# EAGLE design irthrowie (EAGLE 7.1.0)
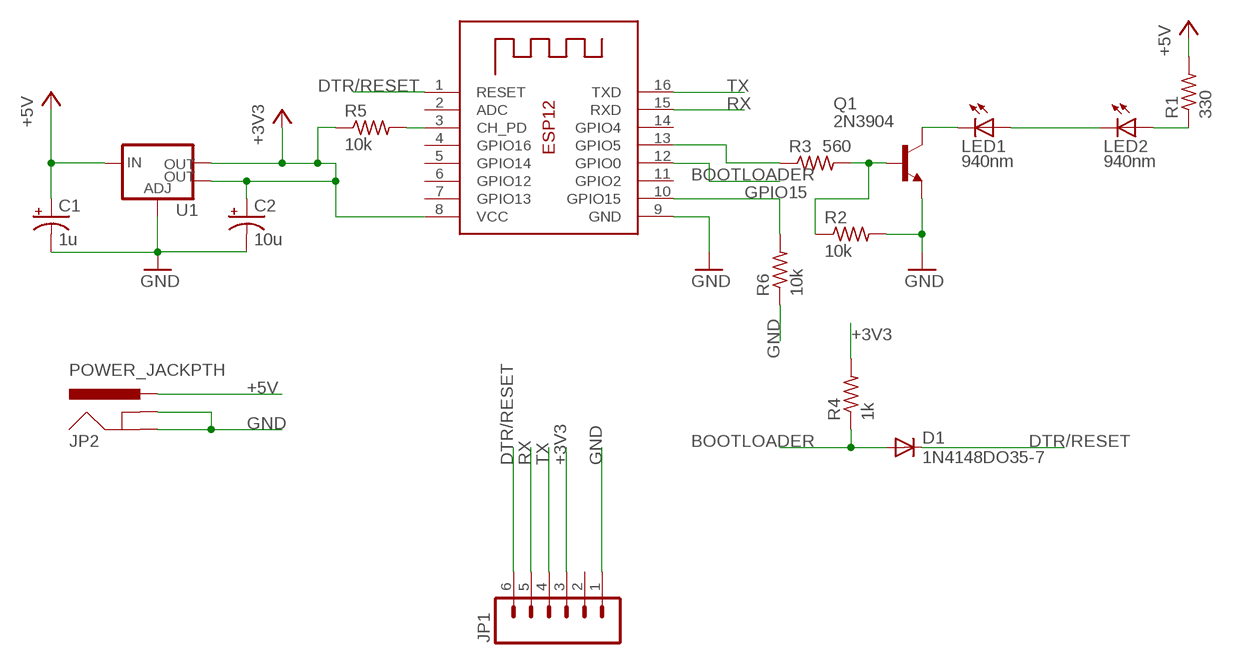
[diagram p0: schematic, sheet 1]

## Parts
C1  1u  CPOL-USB  [PANASONIC_B]
C2  10u  CPOL-USB  [PANASONIC_B]
D1  1N4148DO35-7  [DO35-7]
JP1  M06LOCK  [1X06_LOCK]
JP2  POWER_JACKPTH  [POWER_JACK_PTH]
LED1  940nm  LED5MM  [LED5MM]
LED2  940nm  LED5MM  [LED5MM]
Q1  2N3904  [TO92]
R1  330  R-US_0204/7  [0204/7]
R2  10k  R-US_0204/7  [0204/7]
R3  560  R-US_0204/7  [0204/7]
R4  1k  R-US_0204/7  [0204/7]
R5  10k  R-US_0204/7  [0204/7]
R6  10k  R-US_0204/7  [0204/7]
U1  V_REG_LM1117SOT223  [SOT223]
X1  ESP-12  [ESP-12]

## Nets
+3V3 [power]: C2.+ JP1.3 R4.2 R5.1 U1.2(OUT) U1.4(OUT) X1.8(VCC)
+5V [power]: C1.+ JP2.PWR R1.2 U1.3(IN)
BOOTLOADER: D1.A R4.1 X1.12(GPIO0)
DTR/RESET: D1.C JP1.6 X1.1(RESET)
GND [power]: C1.- C2.- JP1.1 JP2.GND JP2.GNDBREAK Q1.3(E) R2.2 R6.1 U1.1(ADJ) X1.9(GND)
GPIO15: R6.2 X1.10(GPIO15)
N$1 [power]: LED1.A LED2.K(C)
N$2: Q1.2(B) R2.1 R3.2
N$3 [power]: LED1.K(C) Q1.1(C)
N$4 [power]: LED2.A R1.1
N$5: R5.2 X1.3(CH_PD)
N$6: R3.1 X1.13(GPIO5)
RX: JP1.5 X1.15(RXD)
TX: JP1.4 X1.16(TXD)
Unconnected: JP1.2 X1.2(ADC) X1.4(GPIO16) X1.5(GPIO14) X1.6(GPIO12) X1.7(GPIO13) X1.11(GPIO2) X1.14(GPIO4)

## Library data of the parts
C1 C2 = rcl:CPOL-US: POLARIZED CAPACITOR, American symbol
D1 = diode:1N4148: DIODE high speed (Philips)
JP1 = SparkFun-Connectors:M06: Header 6 Standard 6-pin 0.1" header. Use with straight break away headers (SKU : PRT-00116), right angle break away headers (PRT-00553), swiss pins (PRT-00743), machine pins (PRT-00117), and female headers (PRT-00115). Molex polarized connector foot print use with SKU : PRT-08094 with associated crimp pins and housings. NOTES ON THE VARIANTS LOCK and LOCK_LONGPADS... This footprint was designed to help hold the alignment of a through-hole component (i.e. 6-pin header) while soldering it into place. You may notice that each hole has been shifted either up or down by 0.005 of an inch from it's more standard position (which is a perfectly straight line). This slight alteration caused the pins (the squares in the middle) to touch the edges of the holes. Because they are alternating, it causes a "brace" to hold the component in place. 0.005 has proven to be the perfect amount of "off-center" position when using our standard breakaway headers. Although looks a little odd when you look at the bare footprint, once you have a header in there, the alteration is very hard to notice. Also,if you push a header all the way into place, it is covered up entirely on the bottom side. This idea of altering the position of holes to aid alignment will be further integrated into the Sparkfun Library for other footprints. It can help hold any component with 3 or more connection pins.
JP2 = SparkFun-Connectors:POWER_JACK: Power Jack This is the standard 5.5mm barrel jack for power. The PTH is the most common, proven, reliable, footprint. The Slot footprint only works if the mill layer is transmitted to the PCB fab house so be warned. Mating wall wart : TOL-00298 (and others); PROD_ID: CONN-08197
LED1 LED2 = led:LED: LED OSRAM: - CHIPLED LG R971, LG N971, LY N971, LG Q971, LY Q971, LO R971, LY R971 LH N974, LH R974 LS Q976, LO Q976, LY Q976 LO Q996 - Hyper CHIPLED LW Q18S LB Q993, LB Q99A, LB R99A - SideLED LS A670, LO A670, LY A670, LG A670, LP A670 LB A673, LV A673, LT A673, LW A673 LH A674 LY A675 LS A676, LA A676, LO A676, LY A676, LW A676 LS A679, LY A679, LG A679 - Hyper Micro SIDELED® LS Y876, LA Y876, LO Y876, LY Y876 LT Y87S - SmartLED LW L88C, LW L88S LB L89C, LB L89S, LG L890 LS L89K, LO L89K, LY L89K LS L896, LA L896, LO L896, LY L896 - TOPLED LS T670, LO T670, LY T670, LG T670, LP T670 LSG T670, LSP T670, LSY T670, LOP T670, LYG T670 LG T671, LOG T671, LSG T671 LB T673, LV T673, LT T673, LW T673 LH T674 LS T676, LA T676, LO T676, LY T676, LB T676, LH T676, LSB T676, LW T676 LB T67C, LV T67C, LT T67C, LS T67K, LO T67K, LY T67K, LW E67C LS E67B, LA E67B, LO E67B, LY E67B, LB E67C, LV E67C, LT E67C LW T67C LS T679, LY T679, LG T679 LS T770, LO T770, LY T770, LG T770, LP T770 LB T773, LV T773, LT T773, LW T773 LH T774 LS E675, LA E675, LY E675, LS T675 LS T776, LA T776, LO T776, LY T776, LB T776 LHGB T686 LT T68C, LB T68C - Hyper Mini TOPLED® LB M676 - Mini TOPLED Santana® LG M470 LS M47K, LO M47K, LY M47K Source: http://www.osram.convergy.de LUXEON: - LUMILED® LXK2-PW12-R00, LXK2-PW12-S00, LXK2-PW14-U00, LXK2-PW14-V00 LXK2-PM12-R00, LXK2-PM12-S00, LXK2-PM14-U00 LXK2-PE12-Q00, LXK2-PE12-R00, LXK2-PE12-S00, LXK2-PE14-T00, LXK2-PE14-U00 LXK2-PB12-K00, LXK2-PB12-L00, LXK2-PB12-M00, LXK2-PB14-N00, LXK2-PB14-P00, LXK2-PB14-Q00 LXK2-PR12-L00, LXK2-PR12-M00, LXK2-PR14-Q00, LXK2-PR14-R00 LXK2-PD12-Q00, LXK2-PD12-R00, LXK2-PD12-S00 LXK2-PH12-R00, LXK2-PH12-S00 LXK2-PL12-P00, LXK2-PL12-Q00, LXK2-PL12-R00 Source: www.luxeon.com KINGBRIGHT: KA-3528ASYC Source: www.kingbright.com
Q1 = transistor-npn:2N3904: NPN Transistor
R1-R6 = rcl:R-US_: RESISTOR, American symbol
U1 = SparkFun-PowerIC:V_REG_LM1117: Voltage Regulator LM1117 Standard adjustable voltage regulator but in SMD form. Spark Fun Electronics SKU : COM-00595; PROD_ID: VREG-08170
X1 = adafruit:ESP-12

## Net classes
1 power: width 0.61 mm

## Board
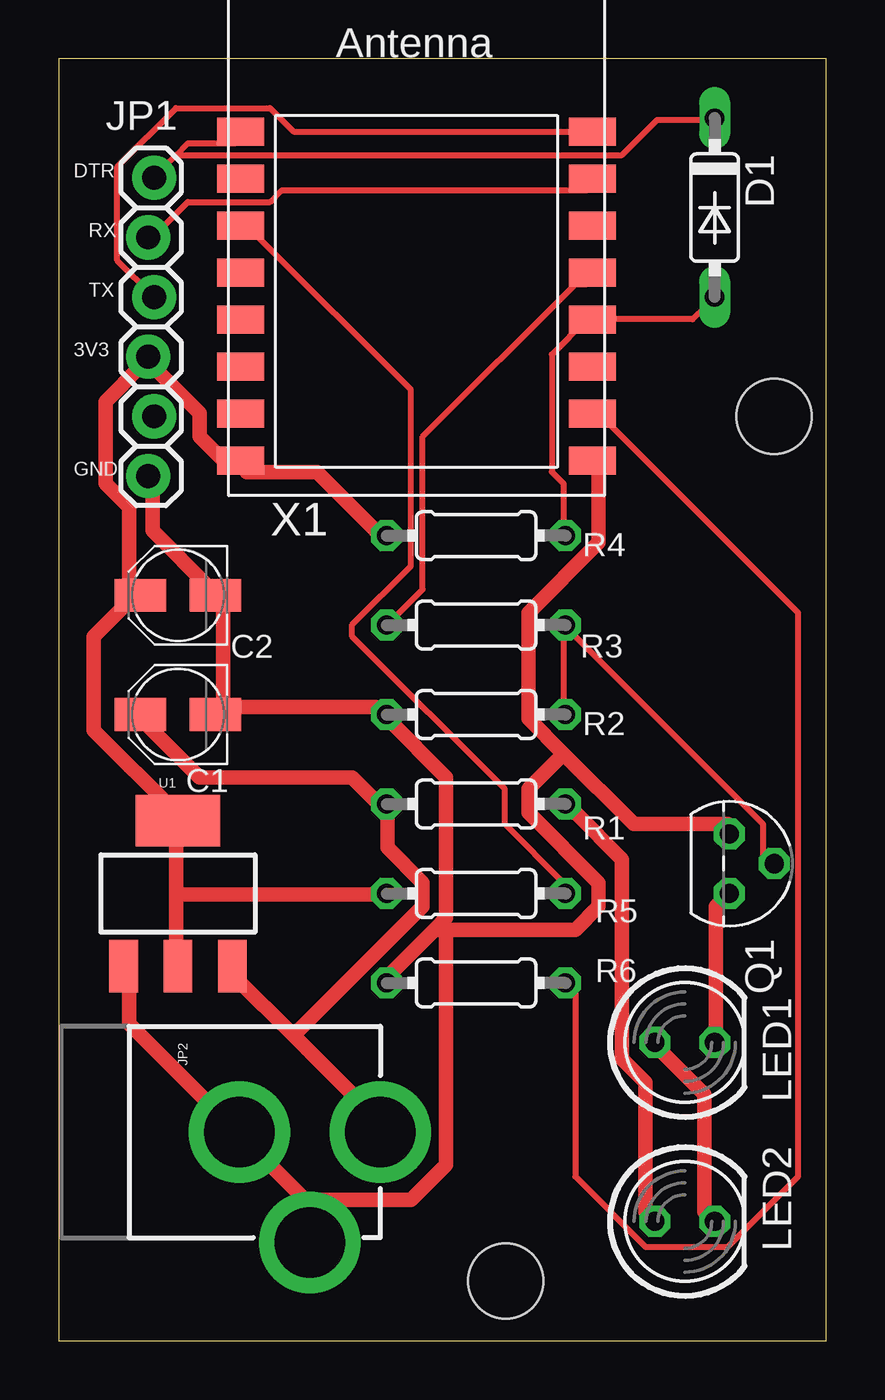
[diagram p1: board, top side]

Size 32.69 x 54.6 mm. Coordinates in mm from the lower left corner, seen from the top.
Outline: 0,0 32.69,0 32.69,54.6 0,54.6 0,0
Copper layers (1*16): Top 0.035mm / dielectric 1.5mm / Bottom 0.035mm
Design rules "default": minimum track width 10mil, minimum drill 24mil, track to track 8mil, track to pad 8mil, pad to pad 8mil, via to via 8mil, smd to smd 8mil, copper to edge 40mil, drill to drill 8mil, minimum pad ring 10mil, minimum via ring 8mil, stop-mask expansion 4mil, vias tented up to drill 0mil, thermal gap 10mil
Holes 3.2 mm at 19.05,2.54 30.48,39.37

### Footprints (pad centres in the part's own frame; a part is rotated, then mirrored left to right if it is on the bottom)
PANASONIC_B = smd 2.2 x 1.4: + 1.6,0; - -1.6,0
DO35-7 = drill 0.813 long: A 3.81,0; C -3.81,0
1X06_LOCK = drill 1.016 pad 1.88: 1 0,0; 2 2.54,-0.254; 3 5.08,0; 4 7.62,-0.254; 5 10.16,0; 6 12.7,-0.254
POWER_JACK_PTH = drill 2.997 pad 4.318: GND 0,7.7; GNDBREAK 4.7,10.7; PWR 0,13.7
LED5MM = drill 0.813 octagon: A -1.27,0; K 1.27,0
TO92 = drill 0.813 octagon: 1 1.27,0; 2 0,1.905; 3 -1.27,0
0204/7 = drill 0.813 octagon: 1 -3.81,0; 2 3.81,0
SOT223 = smd 1.219 x 2.235: 1 -2.311,-3.099; 2 0,-3.099; 3 2.311,-3.099 | smd 3.6 x 2.2: 4 0,3.099
ESP-12 = smd 2 x 1.2: 1 -7.5,4.5; 2 -7.5,2.5; 3 -7.5,0.5; 4 -7.5,-1.5; 5 -7.5,-3.5; 6 -7.5,-5.5; 7 -7.5,-7.5; 8 -7.5,-9.5; 9 7.5,-9.5; 10 7.5,-7.5; 11 7.5,-5.5; 12 7.5,-3.5; 13 7.5,-1.5; 14 7.5,0.5; 15 7.5,2.5; 16 7.5,4.5

### Placement (x,y rotation side)
C1  5.08,26.67 180 top
C2  5.08,31.75 180 top
D1  27.94,48.26 270 top
JP1  3.81,36.83 90 top
JP2  0,8.89 270 top
LED1  26.67,12.7 0 top
LED2  26.67,5.08 0 top
Q1  28.57,20.32 270 top
R1  17.78,22.86 180 top
R2  17.78,26.67 180 top
R3  17.78,30.48 0 top
R4  17.78,34.29 180 top
R5  17.78,19.05 0 top
R6  17.78,15.24 0 top
U1  5.08,19.05 0 top
X1  15.24,46.99 0 top

### Tracks (layer width: path | path; a pad name or v marks a point on that pad's centre or on a via)
+3V3
  Top 0.61: 5,19 5,22 U1.4 5,22.5 1.5,26 1.5,30 3,31.5 C2.+ 3,32 3,35.5 2,36.5 2,40 3.5,41.5 JP1.3 4,41.5 6,39.5 6,38.5 7,37.5 7.5,37.5 X1.8 8,37 11,37 13.5,34.5 R4.2 | 5,19 5,16 U1.2 | 5,19 13.5,19 R5.1
+5V
  Top 0.61: C1.+ 3.5,26.5 6,24 12.5,24 13.5,23 R1.2 14,22.5 14,21 15.5,19.5 15.5,18.5 10,13 | 10,13 14,9 JP2.PWR | 10,13 7.5,15.5 U1.3
BOOTLOADER
  Top 0.254: D1.A 27.5,44 27,43.5 23,43.5 X1.12 22.5,43.5 21,42 21,37 21.5,36.5 21.5,34.5 R4.1
DTR/RESET
  Top 0.254: 5,50.5 4.5,50 JP1.6 | 5,50.5 5.5,51 7.5,51 X1.1 | 5,50.5 24,50.5 25.5,52 27.5,52 D1.C
GND
  Top 0.61: U1.1 3,15.5 3,13.5 7.5,9 JP2.GND 8,8.5 10.5,6 | 10.5,6 10.5,4.5 JP2.GNDBREAK 10.5,6 | 21.5,25 24.5,22 28.5,22 Q1.3 | 21.5,25 20,26.5 20,31 23,34 23,37 X1.9 | 16,17.5 16.5,18 16.5,24 14,26.5 R2.2 13.5,27 7,27 | 16,17.5 14,15.5 R6.1 | 7,27 7,31.5 C2.- 6.5,32 4,34.5 4,36.5 JP1.1 | 7,27 C1.- | 21.5,25 20,23.5 20,22.5 23,19.5 23,18.5 22,17.5 16.5,17.5 | 16,17.5 16.5,17.5 | 10.5,6 15,6 16.5,7.5 16.5,17.5
GPIO15
  Top 0.254: X1.10 23,39 23.5,39 31.5,31 31.5,7 28.5,4 25,4 22,7 22,15 R6.2
N$1
  Top 0.61: LED2.K 27.5,5.5 27.5,10.5 25.5,12.5 LED1.A
N$2
  Top 0.254: R2.1 21.5,27 21.5,30 R3.2 22,30 30,22 30,20.5 Q1.2
N$3
  Top 0.61: LED1.K 28,13 28,18.5 28.5,19 Q1.1
N$4
  Top 0.61: LED2.A 25,5.5 25,11 24,12 24,20.5 22,22.5 R1.1
N$5
  Top 0.254: X1.3 8,47 8.5,47 15,40.5 15,33 12.5,30.5 12.5,30 19,23.5 19,22 21.5,19.5 R5.2
N$6
  Top 0.254: X1.13 22.5,45 22,45 15.5,38.5 15.5,32 14,30.5 R3.1
RX
  Top 0.254: X1.15 22.5,49 9.5,49 9,48.5 5.5,48.5 4,47 JP1.5
TX
  Top 0.254: X1.16 22.5,51.5 10,51.5 9,52.5 5,52.5 2.5,50 2.5,46 4,44.5 JP1.4

### Text on the board
tNames: DTR | RX | TX | 3V3 | GND